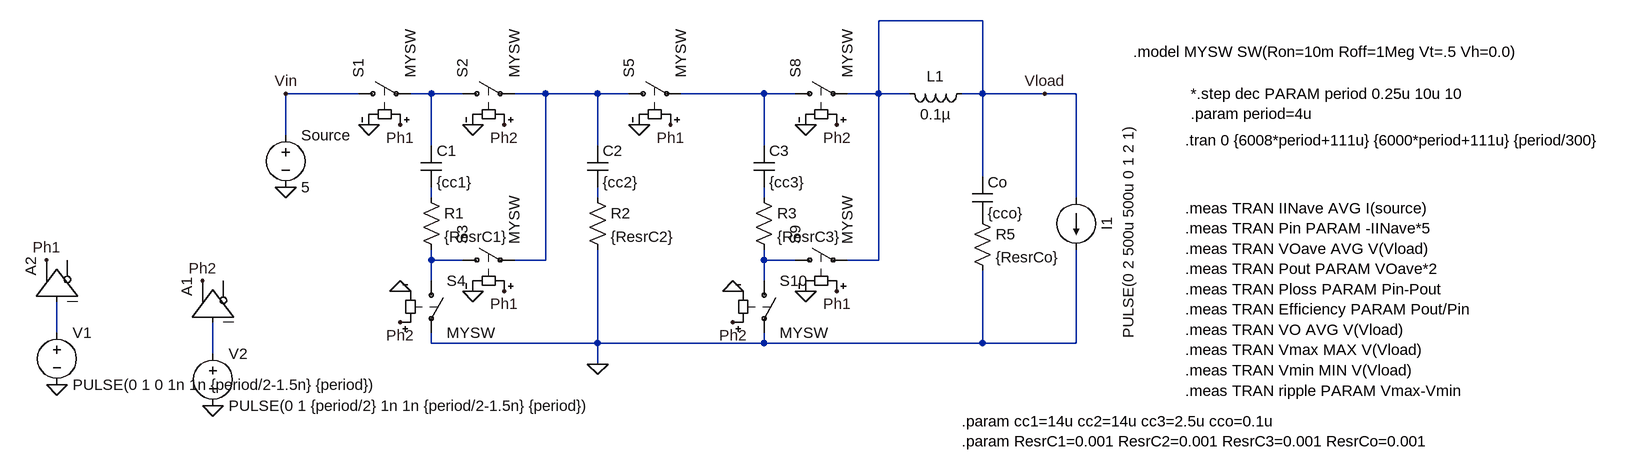
[diagram p0: schematic 4to1_doubler_current_source.asc]
4to1_doubler_current_source.asc, the LTspice schematic file:
Version 4
SHEET 1 1688 680
WIRE 368 -336 208 -336
WIRE -592 -224 -704 -224
WIRE -480 -224 -512 -224
WIRE -432 -224 -480 -224
WIRE -304 -224 -352 -224
WIRE -224 -224 -304 -224
WIRE -176 -224 -224 -224
WIRE 32 -224 -96 -224
WIRE 80 -224 32 -224
WIRE 208 -224 208 -336
WIRE 208 -224 160 -224
WIRE 256 -224 208 -224
WIRE 368 -224 368 -336
WIRE 368 -224 336 -224
WIRE 464 -224 368 -224
WIRE 512 -224 464 -224
WIRE -704 -160 -704 -224
WIRE -480 -144 -480 -224
WIRE -224 -144 -224 -224
WIRE 32 -144 32 -224
WIRE 368 -96 368 -224
WIRE -480 -64 -480 -80
WIRE -224 -64 -224 -80
WIRE 32 -64 32 -80
WIRE 512 -64 512 -224
WIRE -480 32 -480 16
WIRE -432 32 -480 32
WIRE -304 32 -304 -224
WIRE -304 32 -352 32
WIRE 32 32 32 16
WIRE 80 32 32 32
WIRE 208 32 208 -224
WIRE 208 32 160 32
WIRE -480 64 -480 32
WIRE 32 64 32 32
WIRE -1056 144 -1056 96
WIRE -480 160 -480 144
WIRE -224 160 -224 16
WIRE -224 160 -480 160
WIRE 32 160 32 144
WIRE 32 160 -224 160
WIRE 368 160 368 48
WIRE 368 160 32 160
WIRE 512 160 512 16
WIRE 512 160 368 160
WIRE -816 176 -816 128
WIRE -224 192 -224 160
FLAG -816 256 0
FLAG -704 -80 0
FLAG -528 -176 Ph1
FLAG -368 -176 Ph2
FLAG -576 -176 0
FLAG -416 -176 0
FLAG -704 -224 Vin
FLAG 464 -224 Vload
FLAG -832 64 Ph2
FLAG -112 -176 Ph1
FLAG -160 -176 0
FLAG 144 -176 Ph2
FLAG 96 -176 0
FLAG -224 192 0
FLAG -368 80 Ph1
FLAG 144 80 Ph1
FLAG -528 128 Ph2
FLAG -16 128 Ph2
FLAG -528 80 0
FLAG -416 80 0
FLAG -16 80 0
FLAG 96 80 0
FLAG -1056 224 0
FLAG -1072 32 Ph1
SYMBOL voltage -816 160 R0
WINDOW 123 0 0 Left 2
WINDOW 39 0 0 Left 2
SYMATTR InstName V2
SYMATTR Value PULSE(0 1 {period/2} 1n 1n {period/2-1.5n} {period})
SYMBOL Digital\\buf -880 128 R270
SYMATTR InstName A1
SYMBOL voltage -704 -176 R0
WINDOW 123 0 0 Left 2
WINDOW 39 0 0 Left 2
SYMATTR InstName Source
SYMATTR Value 5
SYMBOL sw -608 -224 R270
SYMATTR InstName S1
SYMATTR Value MYSW
SYMBOL sw -448 -224 R270
SYMATTR InstName S2
SYMATTR Value MYSW
SYMBOL cap -496 -144 R0
SYMATTR InstName C1
SYMATTR Value {cc1}
SYMBOL cap 352 -96 R0
SYMATTR InstName Co
SYMATTR Value {cco}
SYMBOL res -496 -80 R0
SYMATTR InstName R1
SYMATTR Value {ResrC1}
SYMBOL res 352 -48 R0
SYMATTR InstName R5
SYMATTR Value {ResrCo}
SYMBOL current 512 -64 R0
WINDOW 0 32 40 VTop 2
WINDOW 3 96 52 VBottom 2
WINDOW 123 0 0 Left 2
WINDOW 39 0 0 Left 2
SYMATTR InstName I1
SYMATTR Value PULSE(0 2 500u 500u 0 1 2 1)
SYMBOL sw -480 48 R0
SYMATTR InstName S4
SYMATTR Value MYSW
SYMBOL sw -448 32 R270
SYMATTR InstName S3
SYMATTR Value MYSW
SYMBOL sw -192 -224 R270
SYMATTR InstName S5
SYMATTR Value MYSW
SYMBOL cap -240 -144 R0
SYMATTR InstName C2
SYMATTR Value {cc2}
SYMBOL res -240 -80 R0
SYMATTR InstName R2
SYMATTR Value {ResrC2}
SYMBOL sw 64 -224 R270
SYMATTR InstName S8
SYMATTR Value MYSW
SYMBOL cap 16 -144 R0
SYMATTR InstName C3
SYMATTR Value {cc3}
SYMBOL res 16 -80 R0
SYMATTR InstName R3
SYMATTR Value {ResrC3}
SYMBOL sw 64 32 R270
SYMATTR InstName S9
SYMATTR Value MYSW
SYMBOL sw 32 48 R0
SYMATTR InstName S10
SYMATTR Value MYSW
SYMBOL ind 352 -240 R90
WINDOW 0 5 56 VBottom 2
WINDOW 3 32 56 VTop 2
SYMATTR InstName L1
SYMATTR Value 0.1µ
SYMBOL voltage -1056 128 R0
WINDOW 123 0 0 Left 2
WINDOW 39 0 0 Left 2
SYMATTR InstName V1
SYMATTR Value PULSE(0 1 0 1n 1n {period/2-1.5n} {period})
SYMBOL Digital\\buf -1120 96 R270
SYMATTR InstName A2
TEXT 600 -288 Left 2 !.model MYSW SW(Ron=10m Roff=1Meg Vt=.5 Vh=0.0)
TEXT 680 -48 Left 2 !.meas TRAN IINave AVG I(source)\n.meas TRAN Pin PARAM -IINave*5\n.meas TRAN VOave AVG V(Vload)\n.meas TRAN Pout PARAM VOave*2\n.meas TRAN Ploss PARAM Pin-Pout\n.meas TRAN Efficiency PARAM Pout/Pin\n.meas TRAN VO AVG V(Vload)\n.meas TRAN Vmax MAX V(Vload)\n.meas TRAN Vmin MIN V(Vload)\n.meas TRAN ripple PARAM Vmax-Vmin
TEXT 336 280 Left 2 !.param cc1=14u cc2=14u cc3=2.5u cco=0.1u\n.param ResrC1=0.001 ResrC2=0.001 ResrC3=0.001 ResrCo=0.001
TEXT 680 -152 Left 2 !.tran 0 {6008*period+111u} {6000*period+111u} {period/300}
TEXT 688 -224 Left 2 !*.step dec PARAM period 0.25u 10u 10\n.param period=4u

The netlist it stands for:
* 4to1_doubler_current_source.asc
V2 N010 0 PULSE(0 1 {period/2} 1n 1n {period/2-1.5n} {period})
A1 N010 0 0 0 0 0 Ph2 0 BUF
V§Source Vin 0 5
S1 Vin N001 Ph1 0 MYSW
S2 N001 N002 Ph2 0 MYSW
C1 N001 N004 {cc1}
Co Vload P001 {cco}
R1 N004 N007 {ResrC1}
R5 P001 0 {ResrCo}
I1 Vload 0 PULSE(0 2 500u 500u 0 1 2 1)
S4 N007 0 Ph2 0 MYSW
S3 N007 N002 Ph1 0 MYSW
S5 N002 N003 Ph1 0 MYSW
C2 N002 N005 {cc2}
R2 N005 0 {ResrC2}
S8 N003 Vload Ph2 0 MYSW
C3 N003 N006 {cc3}
R3 N006 N008 {ResrC3}
S9 N008 Vload Ph1 0 MYSW
S10 N008 0 Ph2 0 MYSW
L1 Vload Vload 0.1µ
V1 N009 0 PULSE(0 1 0 1n 1n {period/2-1.5n} {period})
A2 N009 0 0 0 0 0 Ph1 0 BUF
.model MYSW SW(Ron=10m Roff=1Meg Vt=.5 Vh=0.0)
.meas TRAN IINave AVG I(source)
.meas TRAN Pin PARAM -IINave*5
.meas TRAN VOave AVG V(Vload)
.meas TRAN Pout PARAM VOave*2
.meas TRAN Ploss PARAM Pin-Pout
.meas TRAN Efficiency PARAM Pout/Pin
.meas TRAN VO AVG V(Vload)
.meas TRAN Vmax MAX V(Vload)
.meas TRAN Vmin MIN V(Vload)
.meas TRAN ripple PARAM Vmax-Vmin
.param cc1=14u cc2=14u cc3=2.5u cco=0.1u
.param ResrC1=0.001 ResrC2=0.001 ResrC3=0.001 ResrCo=0.001
.tran 0 {6008*period+111u} {6000*period+111u} {period/300}
*.step dec PARAM period 0.25u 10u 10
.param period=4u
.backanno
.end